# EAGLE design Current Sense (EAGLE 6.3)
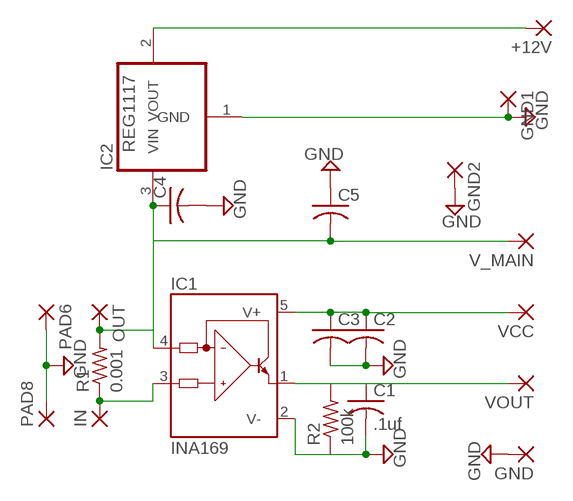
[diagram p0: schematic, sheet 1]

## Parts
+12V  SMD2  [SMD1,27-2,54]
C1  .1uf  C-USC0805K  [C0805K]
C2  C-USC0805K  [C0805K]
C3  C-USC0805K  [C0805K]
C4  C-USC0805K  [C0805K]
C5  C-USC0805K  [C0805K]
GND  SMD2  [SMD1,27-2,54]
GND1  SMD2  [SMD1,27-2,54]
GND2  SMD2  [SMD1,27-2,54]
IC1  INA169  INA138  [SOT23-5]
IC2  REG1117  [SOT223]
IN  SMD5  [SMD2,54-5,08]
OUT  SMD5  [SMD2,54-5,08]
PAD6  SMD5  [SMD2,54-5,08]
PAD8  SMD5  [SMD2,54-5,08]
R1  0.001  R-US_R2512  [R2512]
R2  100k  R-US_R0805  [R0805]
V_MAIN  SMD2  [SMD1,27-2,54]
VCC  SMD2  [SMD1,27-2,54]
VOUT  SMD2  [SMD1,27-2,54]

## Nets
+12V: +12V.1(P) IC2.2(VOUT)
GND: C1.2 C2.2 C3.2 C4.2 C5.1 GND1.1(P) GND2.1(P) GND.1(P) IC1.2(V-) IC2.1(GND) PAD6.1(P) PAD8.1(P) R2.1
N$2: IC1.3(IN+) IN.1(P) R1.1
N$5: C1.1 IC1.1(OUT) R2.2 VOUT.1(P)
OUT: C4.1 C5.2 IC1.4(IN-) IC2.3(VIN) OUT.1(P) R1.2 V_MAIN.1(P)
VCC: C2.1 C3.1 IC1.5(V+) VCC.1(P)

## Library data of the parts
+12V GND GND1 GND2 V_MAIN VCC VOUT = wirepad:SMD2: SMD PAD
C1-C5 = adafruit:C-US: CAPACITOR, American symbol
IC1 = burr-brown:INA138: High-Side Measurement Current Shunt Monitor; MF: TEXAS INSTRUMENTS; MPN: INA138NA/250; OC_FARNELL: 1564888; OC_NEWARK: 80K5906
IC2 = burr-brown:REG1117: 800mA and 1A Low Dropout (LDO) Positive Regulator 1.8V, 2.5V, 2.85V, 3.3V, 5V, and Adj; MPN: REG1117; OC_FARNELL: 1097566; OC_NEWARK: 14P6981
IN OUT PAD6 PAD8 = wirepad:SMD5: SMD PAD
R1 R2 = adafruit:R-US_: RESISTOR, American symbol

## Board
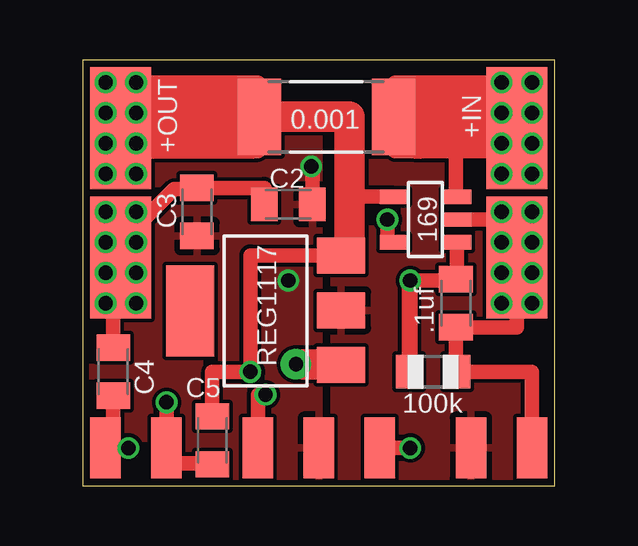
[diagram p1: board, top side]
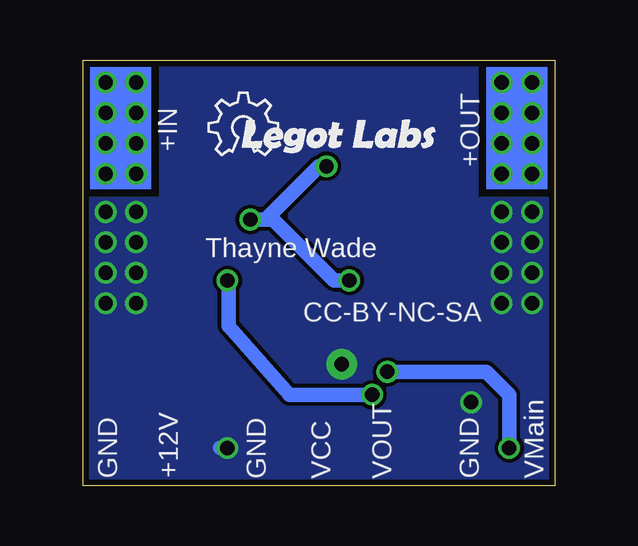
[diagram p2: board, bottom side, seen from below]

Size 19.67 x 17.77 mm. Coordinates in mm from the lower left corner, seen from the top.
Outline: 0,0 19.67,0 19.67,17.77 0,17.77 0,0
Copper layers (1*16): Top 0.035mm / dielectric 1.5mm / Bottom 0.035mm
Design rules "Fusion_eagle_rule_v1.1": minimum track width 6mil, minimum drill 12mil, track to track 6mil, track to pad 6mil, pad to pad 6mil, via to via 6mil, smd to smd 0mil, copper to edge 10mil, drill to drill 10mil, minimum pad ring 10mil, minimum via ring 6mil, stop-mask expansion 2mil, vias tented up to drill 100mil, thermal gap 10mil

### Footprints (pad centres in the part's own frame; a part is rotated, then mirrored left to right if it is on the bottom)
SMD1,27-2,54 = smd 1.27 x 2.54: 1 0,0
C0805K = smd 1.1 x 1.4: 1 -1,0; 2 1,0
SOT23-5 = smd 0.6 x 1.2: 1 -0.95,-1.306; 2 0,-1.306; 3 0.95,-1.306; 4 0.95,1.306; 5 -0.95,1.306
SOT223 = smd 1.499 x 2.007: 1 -2.261,-3.15; 2 0.025,-3.15; 3 2.311,-3.15 | smd 3.81 x 2.007: 4 0,3.15
SMD2,54-5,08 = smd 2.54 x 5.08: 1 0,0
R2512 = smd 1.8 x 3.2: 1 -2.8,0; 2 2.8,0
R0805 = smd 1.1 x 1.4: 1 -1,0; 2 1,0

### Placement (x,y rotation side)
+12V  16.19,1.59 180 top
C1  15.56,7.62 270 top
C2  8.57,11.75 180 top
C3  4.76,11.43 90 top
C4  1.27,4.76 90 top
C5  5.4,1.91 90 top
GND  12.38,1.59 0 top
GND1  18.73,1.59 0 top
GND2  3.49,1.59 0 top
IC1  14.29,11.11 90 top
IC2  7.62,7.3 90 top
IN  18.1,14.92 180 top
OUT  1.59,14.92 180 top
PAD6  18.1,9.53 180 top
PAD8  1.59,9.53 180 top
R1  10.16,15.4 180 top
R2  14.61,4.76 180 top
V_MAIN  0.95,1.59 0 top
VCC  9.84,1.59 0 top
VOUT  7.3,1.59 0 top

### Tracks (layer width: path | path; a pad name or v marks a point on that pad's centre or on a via)
+12V
  pour Top: 19.37,17.46 10.48,17.46 10.48,0.32 19.37,0.32
GND  (via drill 0.6, 0.6 pad 1.27)
  Top 0.61: IC1.2 17.46,11.11 v17.46,11.43 | 18.1,8.26 17.46,8.26 v17.46,7.62 | v18.73,7.62 18.1,7.62 18.1,6.62 C1.2 15.56,4.76 R2.1 18.73,4.76 GND1.1 | GND.1 v13.65,1.59 | 10.77,5.08 v8.89,5.08 | C5.1 5.4,0.95 3.49,0.95 GND2.1 v3.49,3.49 | C2.2 7.57,12.43 C3.2 4.71,12.38 3.81,12.38 2.54,11.11 v2.22,11.43 | C4.2 1.27,7.3 v0.95,7.62 | PAD8.1 v2.22,10.16 | PAD6.1 v17.46,10.16
  Top 1.27: IC2.1 10.77,5.08 9.21,5.08
  Bottom 0.61: v13.65,1.59 13.97,1.59
  other vias: 18.73,11.43 18.73,10.16 17.46,8.89 18.73,8.89 0.95,11.43 0.95,10.16 0.95,8.89 2.22,8.89 2.22,7.62
  pour Bottom: 3.33,17.62 16.35,17.62 16.35,11.91 19.37,11.91 19.37,0.32 0.32,0.32 0.32,11.91 3.33,11.91
N$1
  Top 0.61: 13.02,16.67 17.46,16.67 17.46,16.19 13.49,16.19 13.49,16.35
N$2  (via drill 0.6)
  Top 0.406: 13.97,14.92 R1.1
  Top 0.61: IC1.3 15.56,12.06 15.56,14.92 | v17.46,16.83 v18.73,16.83 | v18.73,16.83 v18.73,15.56 | v18.73,14.29 v18.73,13.02 | v17.46,13.02 v17.46,14.29 IN.1 | v18.73,15.56 IN.1 | v18.73,14.29 IN.1 | IN.1 v17.46,15.56 | v18.73,15.56 v18.73,14.29 | IN.1 18.1,16.19 v18.73,16.83
  Top 2.54: IN.1 15.56,14.92 13.97,14.92
N$3
  Top 0.61: 13.34,15.88 13.81,15.88 13.81,16.83 | 13.81,16.83 13.97,16.83 17.94,16.83 17.94,16.03 | 13.81,16.83 13.02,16.83 13.02,15.56
N$4
  Top 0.61: 6.19,13.97 7.3,13.97 7.3,14.76
N$5  (via drill 0.6)
  Top 0.61: 15.56,10.16 IC1.1 15.59,8.62 C1.1 15.56,8.57 v13.65,8.57 | v13.65,8.57 13.65,4.76 R2.2 13.61,8.57 v13.65,8.57 | VOUT.1 7.3,3.81 v7.62,3.81
  Bottom 0.61: v7.62,3.81 11.06,3.81 13.61,6.67 13.61,8.53 v13.65,8.57
N$6
  Top 0.61: 14.45,13.97 13.02,13.97 13.02,15.08
OUT  (via drill 0.6)
  Top 0.406: 6.99,14.92 R1.2
  Top 0.61: v1.91,1.59 V_MAIN.1 1.27,1.91 C4.1 | 11.11,10.16 10.77,10.16 IC2.3 6.99,9.61 v6.99,4.76 5.4,4.76 C5.2 | IC1.4 11.11,12.06 | v0.95,16.83 v2.22,16.83 v2.22,15.56 2.22,14.92 v2.22,14.29 | v2.22,14.29 v2.22,13.02 | v0.95,13.02 v0.95,14.29 v2.22,14.29 | v0.95,15.56 v2.22,14.29 | R1.2 6.67,15.4 6.67,16.35 | 6.67,16.35 6.67,16.83 | 6.67,16.83 2.54,16.83 2.54,16.35 6.67,16.35 | 6.67,16.83 7.3,16.83 7.3,16.03
  Top 1.27: 7.46,15.4 R1.2 11.11,15.4 11.11,12.06 11.11,10.16
  Top 2.54: OUT.1 2.22,14.92 6.99,14.92
  Bottom 0.61: v1.91,1.59 1.91,3.81 2.86,4.76 v6.99,4.76
VCC  (via drill 0.6)
  Top 0.61: IC1.5 12.7,10.16 v12.7,11.11 | C2.1 9.57,13.34 v9.53,13.34
  Bottom 0.61: v12.7,11.11 12.06,11.11 | 12.06,11.11 11.75,11.11 9.21,8.57 v8.57,8.57 | v9.53,13.34 9.84,13.34 12.06,11.11
  pour Top: 0.32,17.46 9.84,17.46 9.84,0.32 0.32,0.32
(copper drawn outside any net)
  shapes: Bottom area x2

### Text on the board
tNames: +OUT | +IN | 169 | C:/Program Files (x86)/EAGLE_PCB/Legot Labs-Open Source BITMAP.bmp
bNames: +OUT | +IN | Thayne Wade | CC-BY-NC-SA | VMain | GND | GND
209bmp: C:/Program Files (x86)/EAGLE_PCB/Legot Labs-Open Source BITMAP.bmp | C:/Program Files (x86)/EAGLE_PCB/Legot Labs-Open Source BITMAP.bmp | C:/Program Files (x86)/EAGLE_PCB/Legot Labs-Open Source BITMAP.bmp | C:/Program Files (x86)/EAGLE_PCB/Legot Labs-Open Source BITMAP.bmp